# EAGLE schematic sensor_003 (EAGLE 7.3.0)
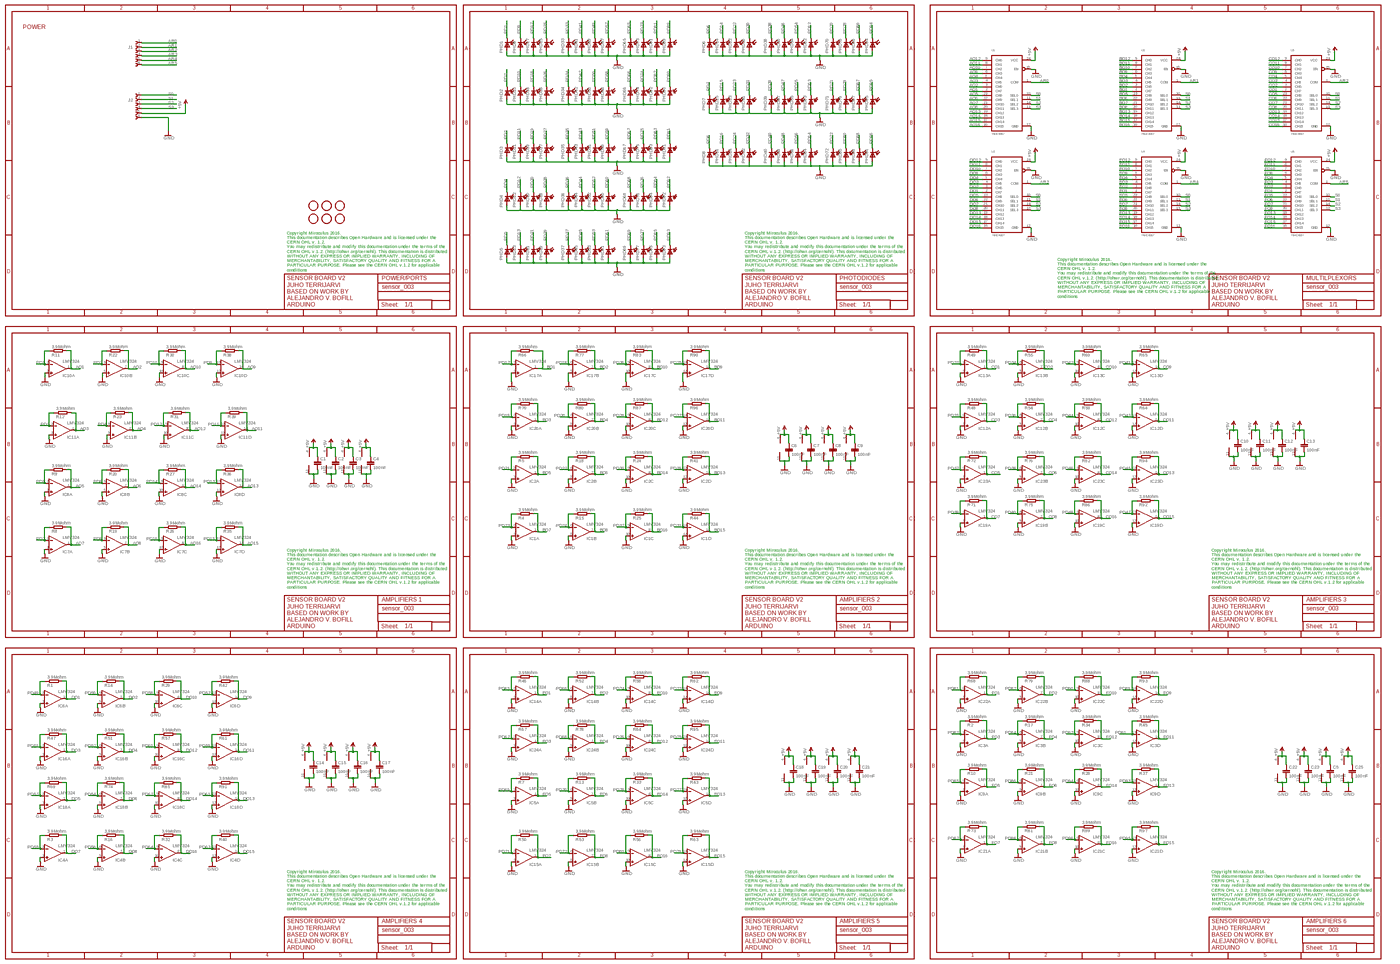
[diagram p0: schematic, sheet 1, overview]
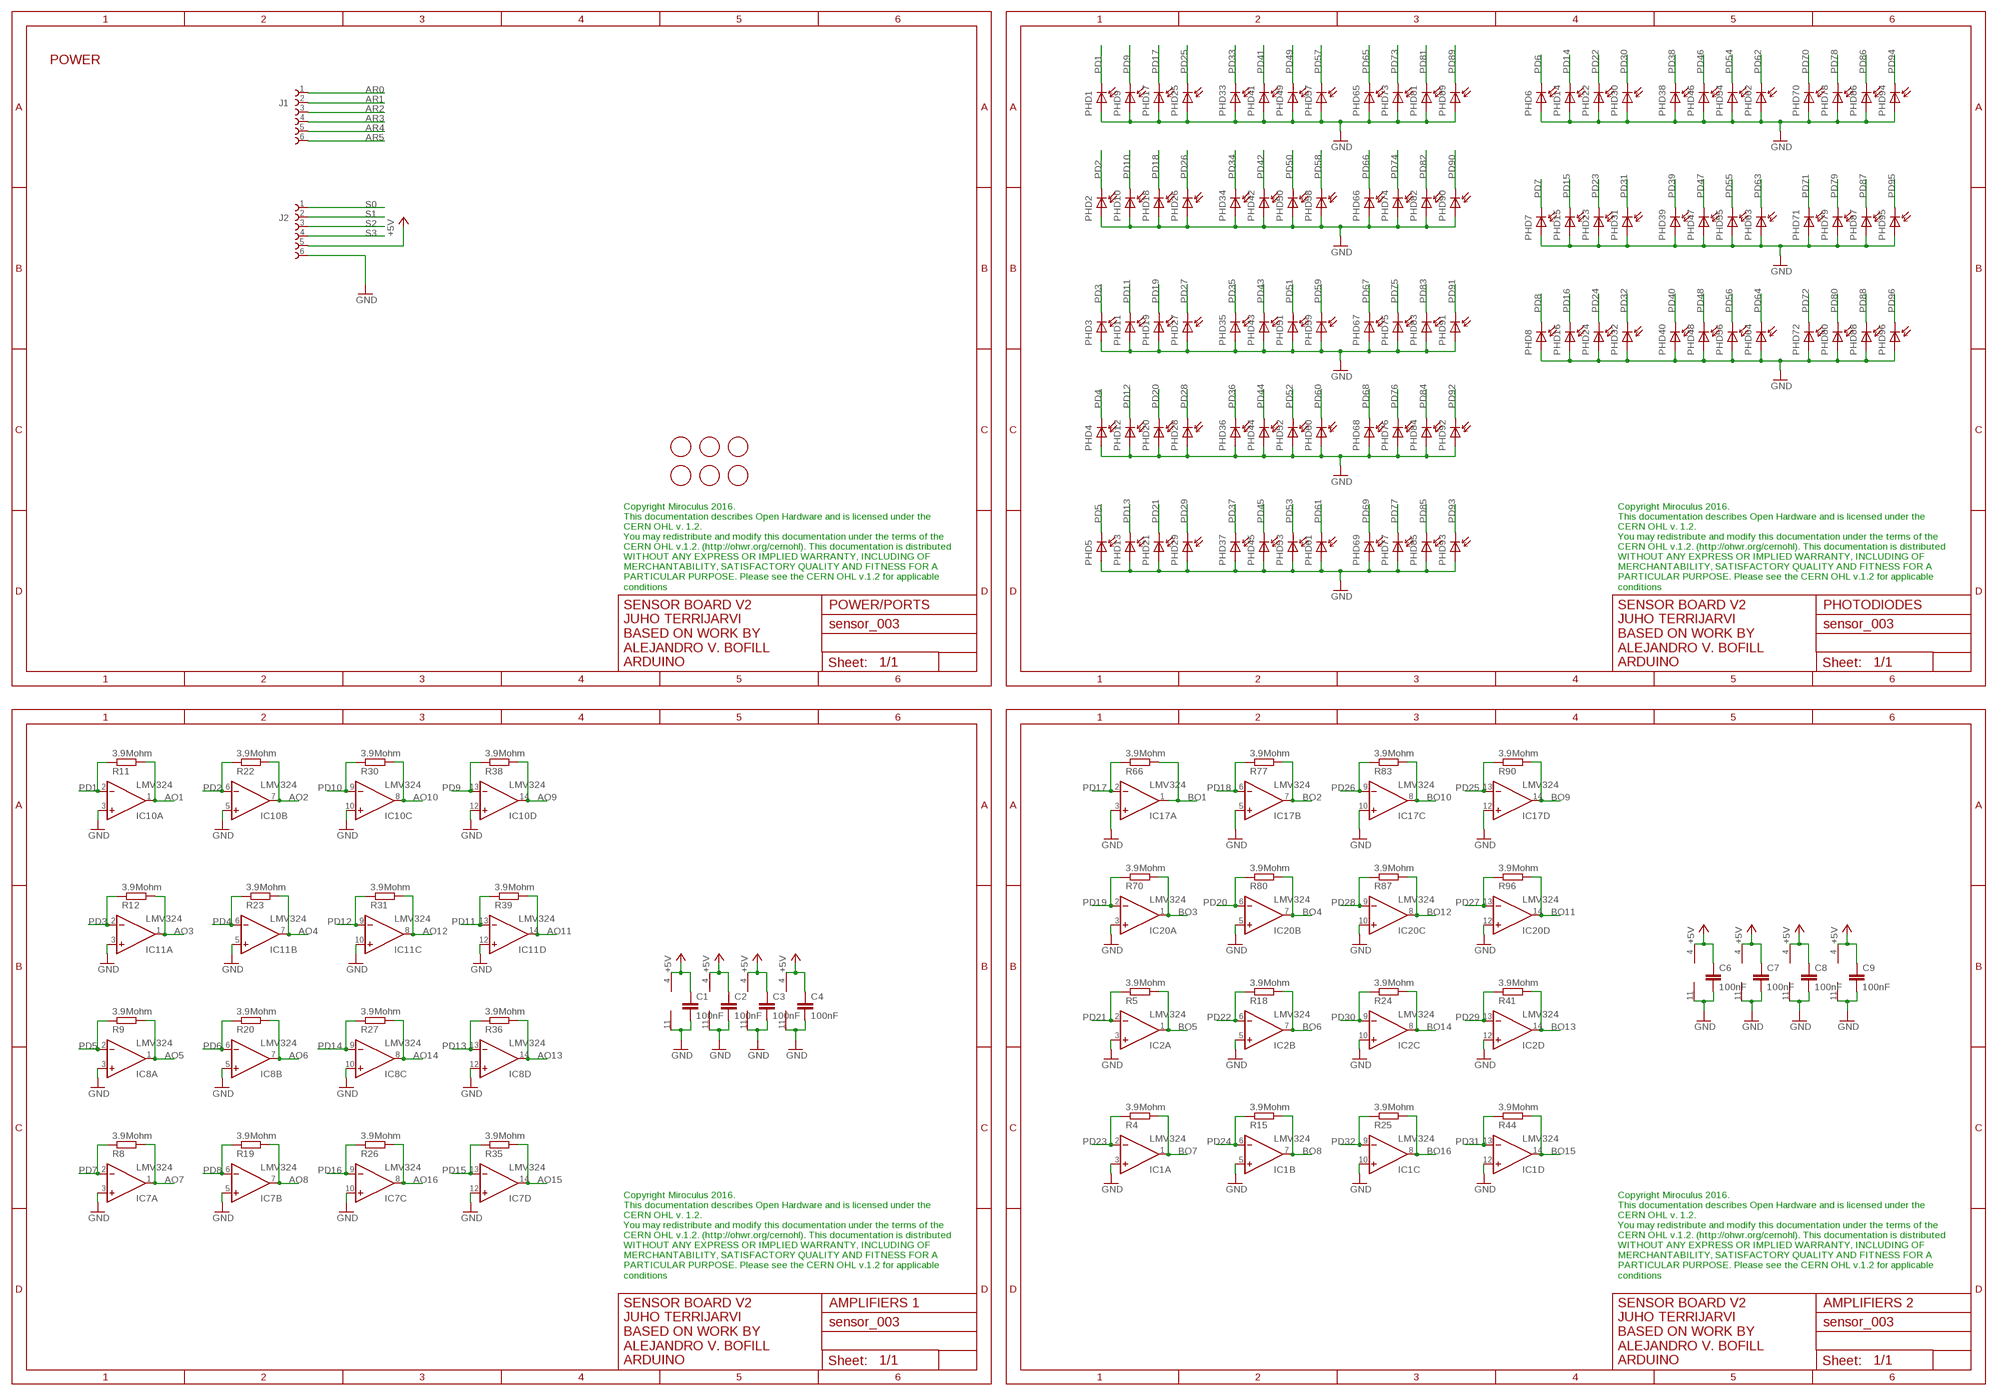
[diagram p1: schematic, sheet 1, part 1 of 4]
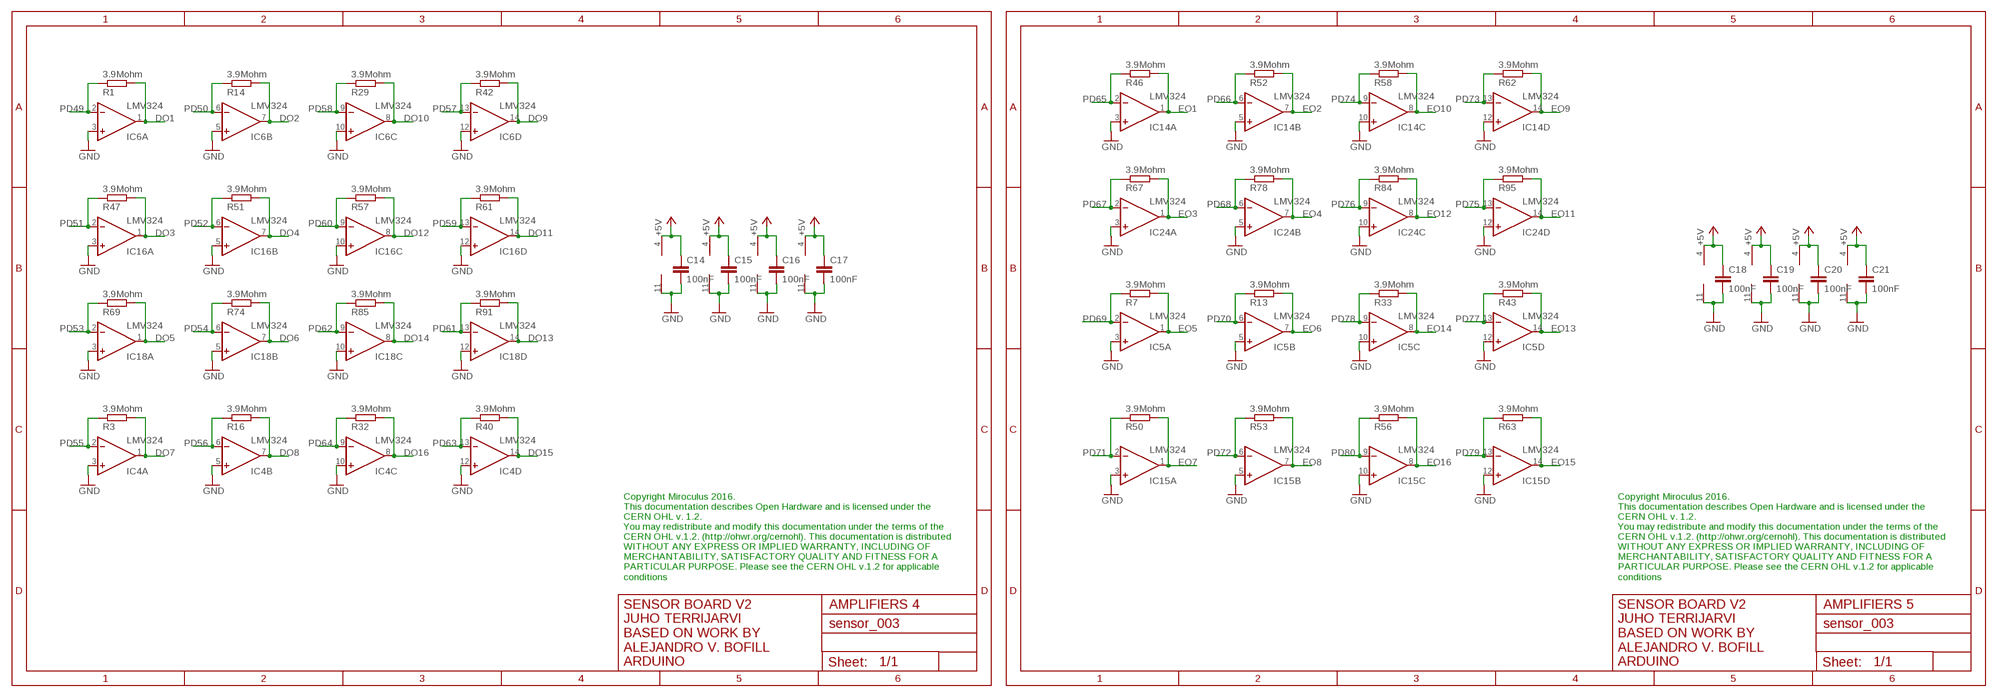
[diagram p2: schematic, sheet 1, part 2 of 4]
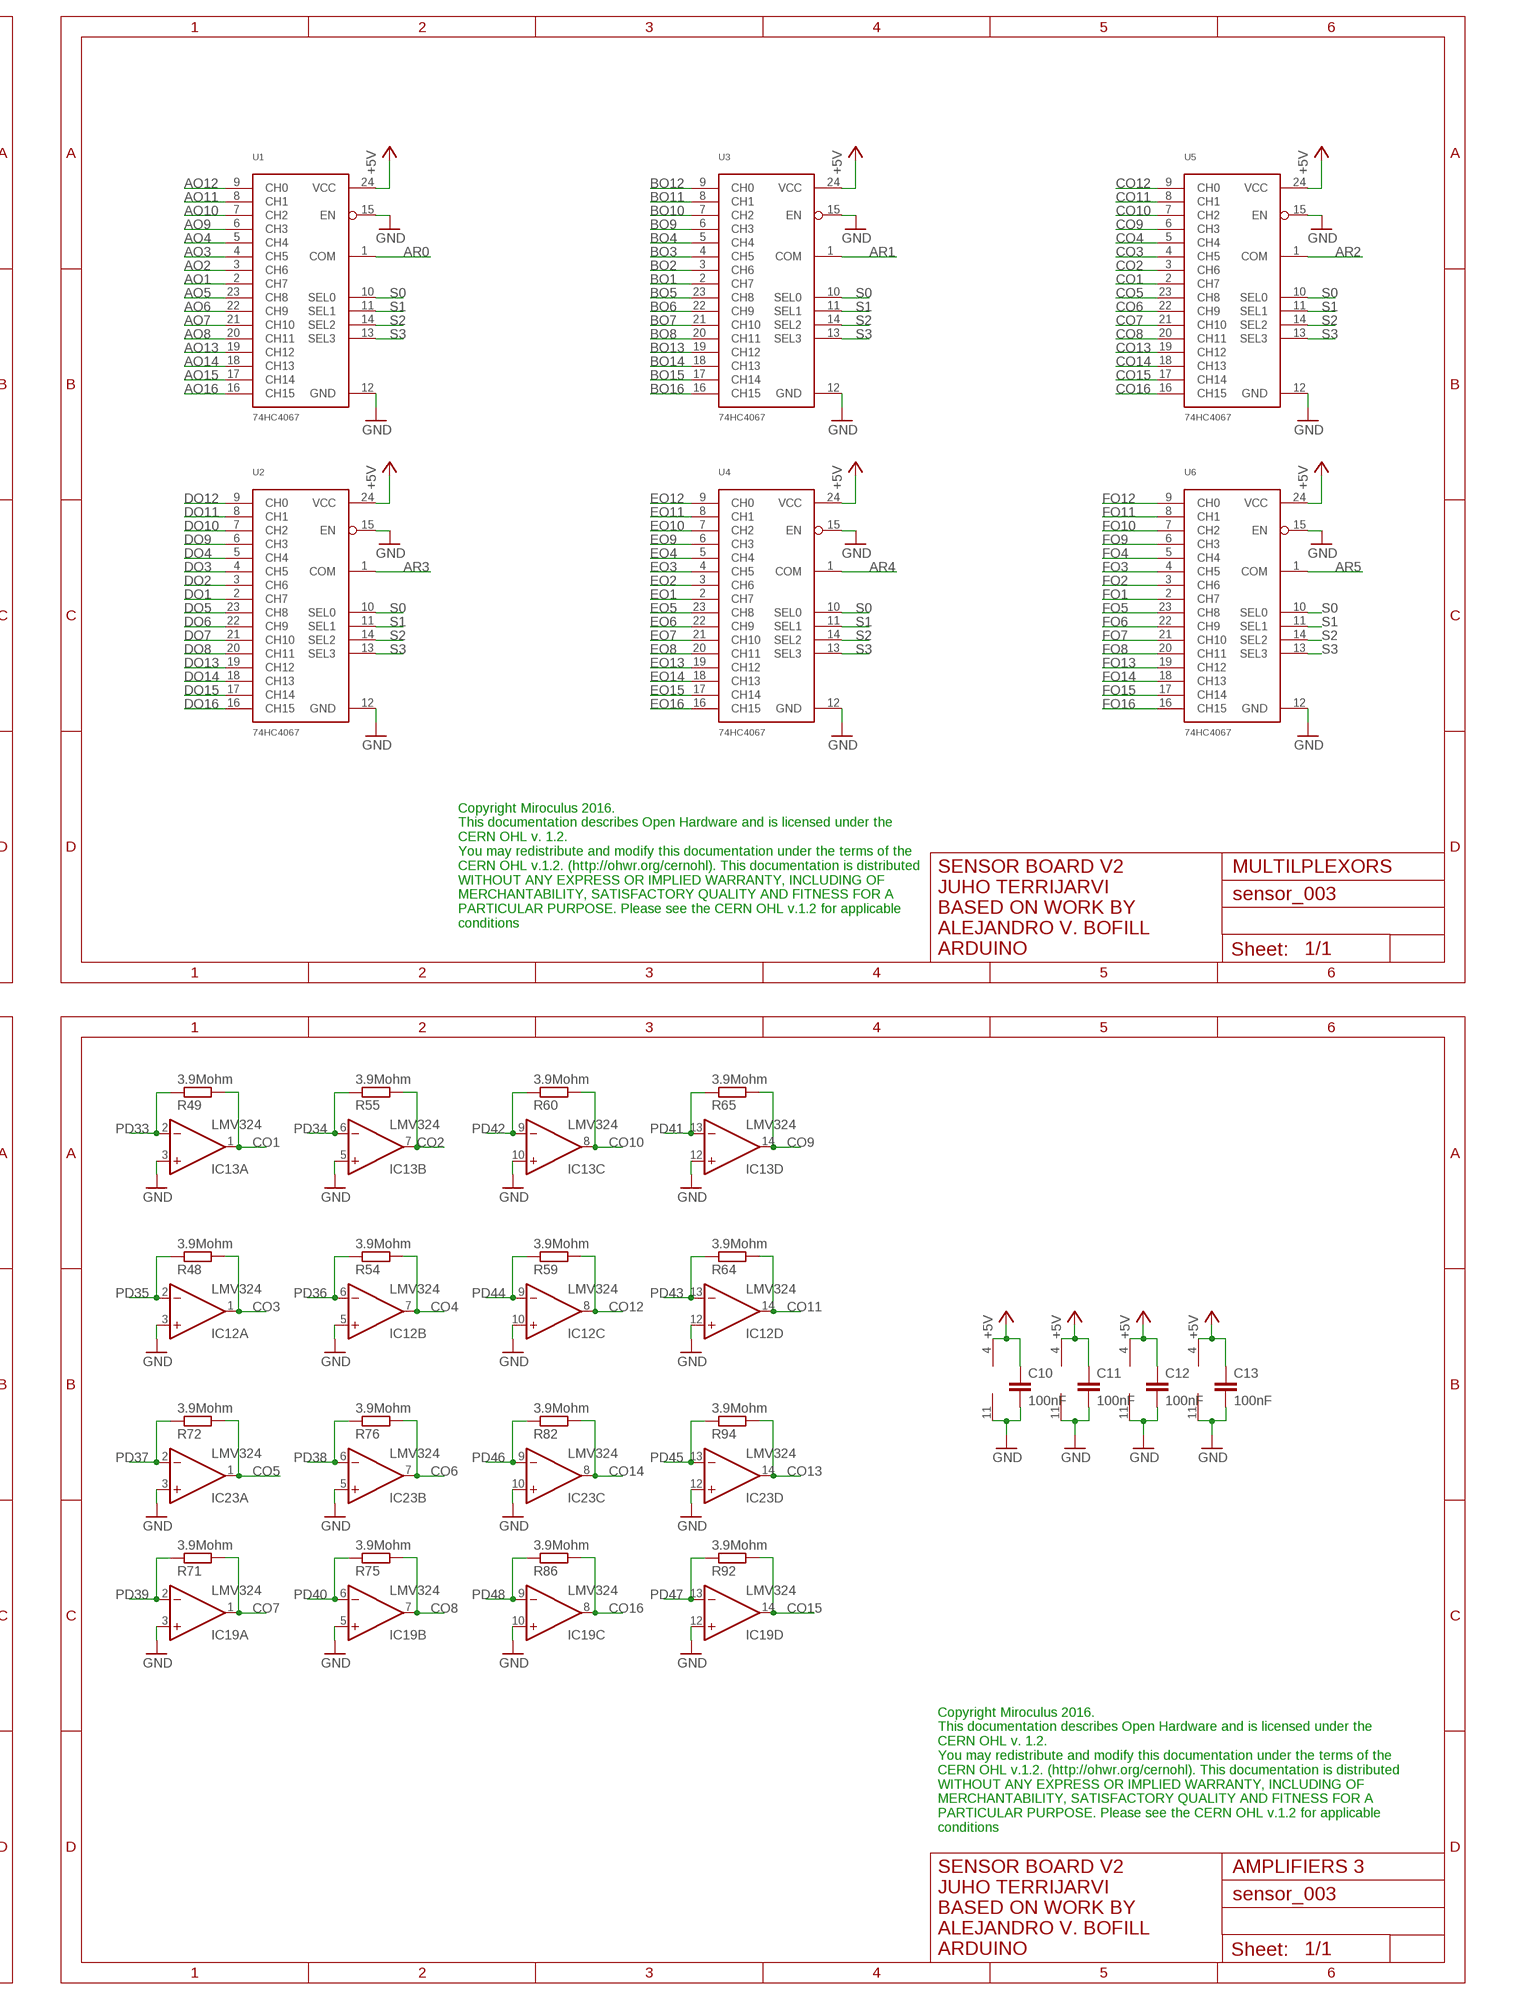
[diagram p3: schematic, sheet 1, part 3 of 4]
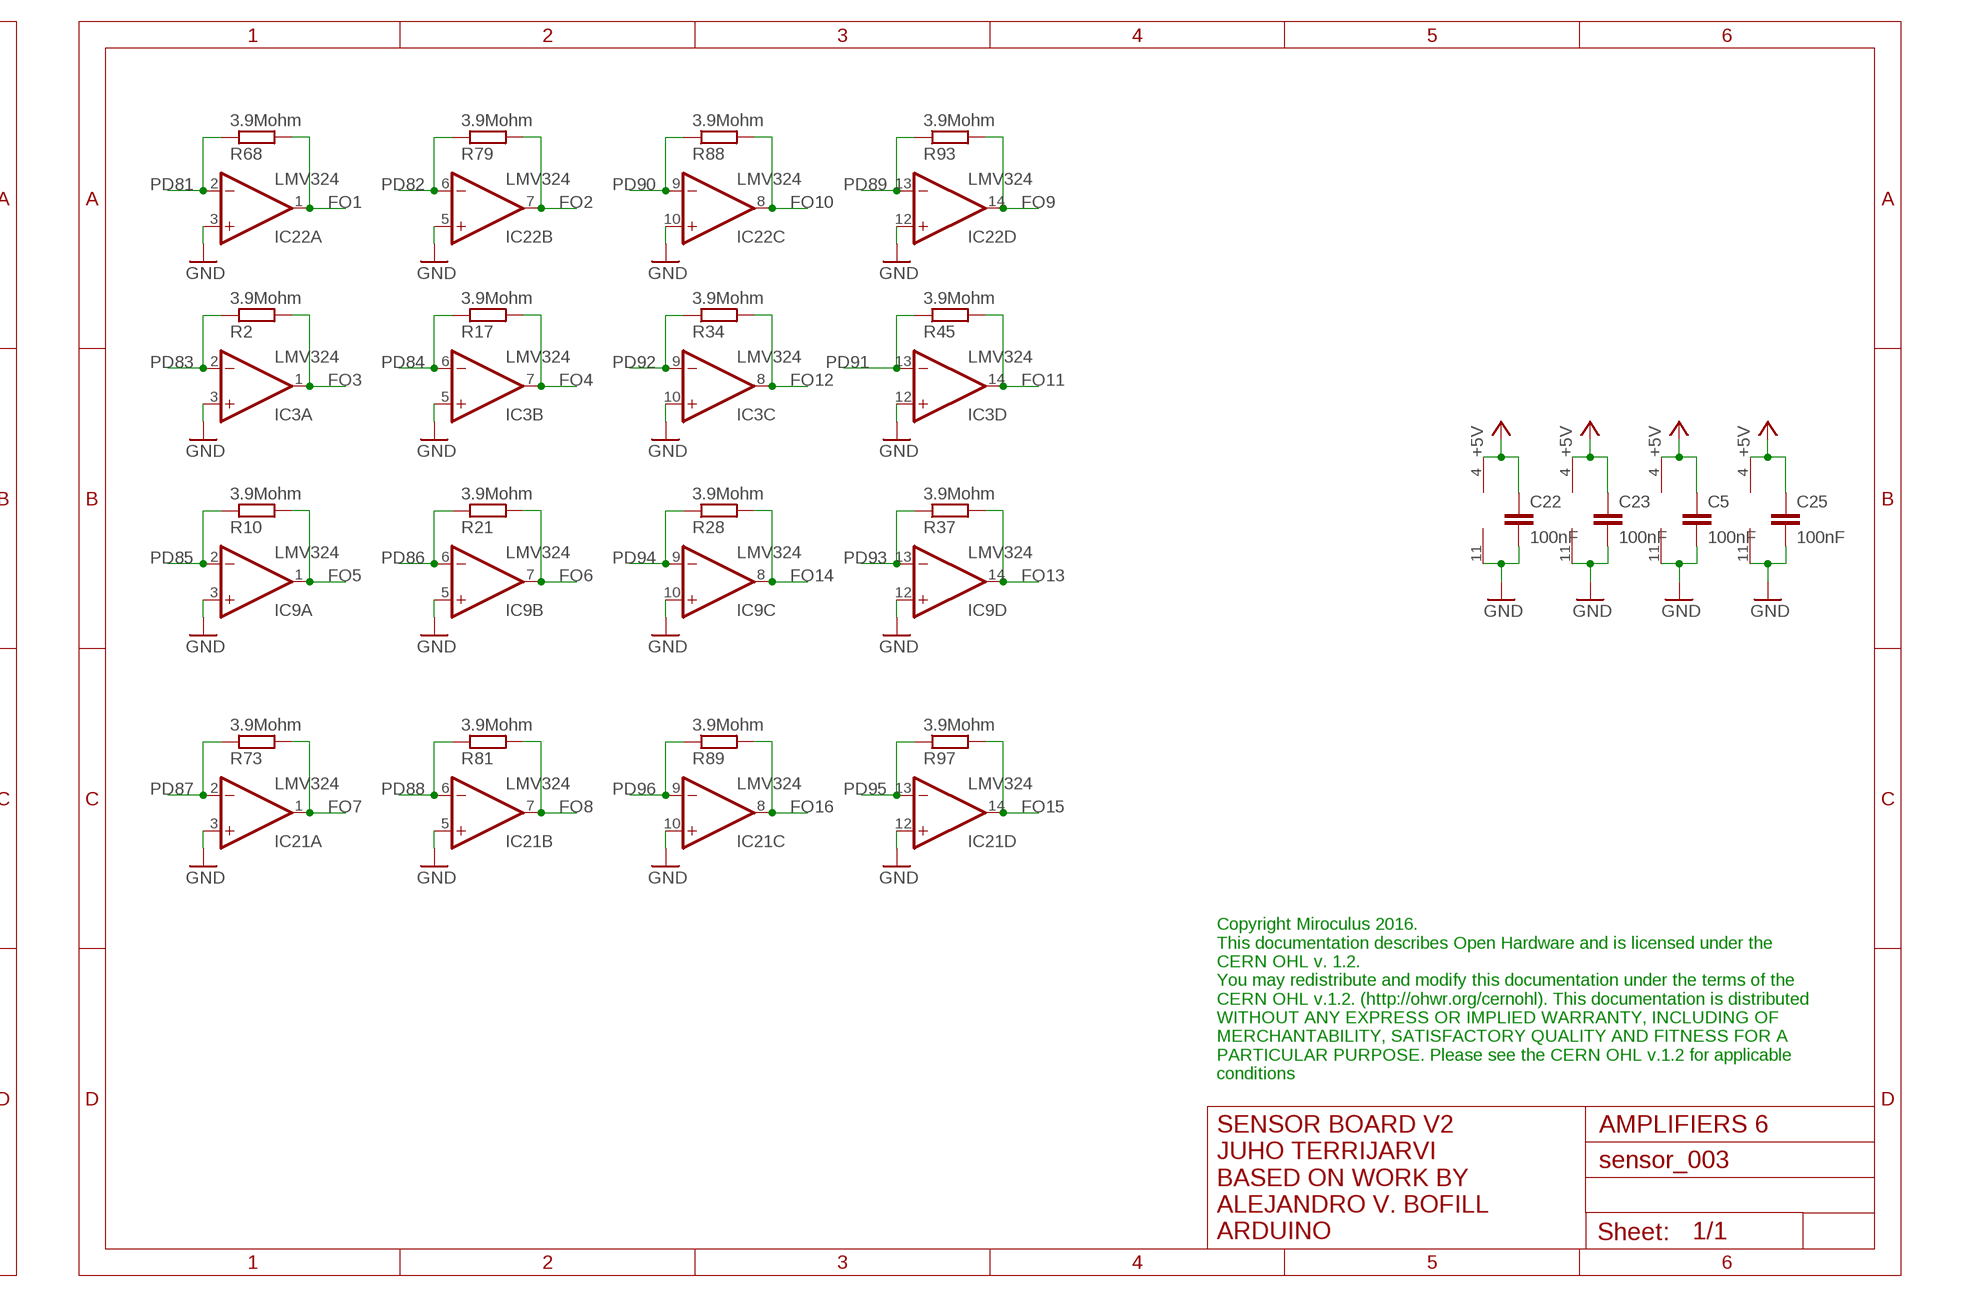
[diagram p4: schematic, sheet 1, part 4 of 4]

## Parts
C1  100nF  C-EUC0603  [C0603]
C2  100nF  C-EUC0603  [C0603]
C3  100nF  C-EUC0603  [C0603]
C4  100nF  C-EUC0603  [C0603]
C5  100nF  C-EUC0603  [C0603]
C6  100nF  C-EUC0603  [C0603]
C7  100nF  C-EUC0603  [C0603]
C8  100nF  C-EUC0603  [C0603]
C9  100nF  C-EUC0603  [C0603]
C10  100nF  C-EUC0603  [C0603]
C11  100nF  C-EUC0603  [C0603]
C12  100nF  C-EUC0603  [C0603]
C13  100nF  C-EUC0603  [C0603]
C14  100nF  C-EUC0603  [C0603]
C15  100nF  C-EUC0603  [C0603]
C16  100nF  C-EUC0603  [C0603]
C17  100nF  C-EUC0603  [C0603]
C18  100nF  C-EUC0603  [C0603]
C19  100nF  C-EUC0603  [C0603]
C20  100nF  C-EUC0603  [C0603]
C21  100nF  C-EUC0603  [C0603]
C22  100nF  C-EUC0603  [C0603]
C23  100nF  C-EUC0603  [C0603]
C25  100nF  C-EUC0603  [C0603]
FD1  FIDUCIALMOUNT  [FIDUCIA-MOUNT]
FD2  FIDUCIALMOUNT  [FIDUCIA-MOUNT]
FD3  FIDUCIALMOUNT  [FIDUCIA-MOUNT]
FD4  FIDUCIALMOUNT  [FIDUCIA-MOUNT]
FD5  FIDUCIALMOUNT  [FIDUCIA-MOUNT]
FD6  FIDUCIALMOUNT  [FIDUCIA-MOUNT]
IC1  LMV324  TL074D  [SO14]
IC2  LMV324  TL074D  [SO14]
IC3  LMV324  TL074D  [SO14]
IC4  LMV324  TL074D  [SO14]
IC5  LMV324  TL074D  [SO14]
IC6  LMV324  TL074D  [SO14]
IC7  LMV324  TL074D  [SO14]
IC8  LMV324  TL074D  [SO14]
IC9  LMV324  TL074D  [SO14]
IC10  LMV324  TL074D  [SO14]
IC11  LMV324  TL074D  [SO14]
IC12  LMV324  TL074D  [SO14]
IC13  LMV324  TL074D  [SO14]
IC14  LMV324  TL074D  [SO14]
IC15  LMV324  TL074D  [SO14]
IC16  LMV324  TL074D  [SO14]
IC17  LMV324  TL074D  [SO14]
IC18  LMV324  TL074D  [SO14]
IC19  LMV324  TL074D  [SO14]
IC20  LMV324  TL074D  [SO14]
IC21  LMV324  TL074D  [SO14]
IC22  LMV324  TL074D  [SO14]
IC23  LMV324  TL074D  [SO14]
IC24  LMV324  TL074D  [SO14]
J1  68710614522  [68710614522]
J2  68710614522  [68710614522]
PHD1  CLS15-22C/L213G/TR8  PD_0.2  [PD_0.2]
PHD2  CLS15-22C/L213G/TR8  PD_0.2  [PD_0.2]
PHD3  CLS15-22C/L213G/TR8  PD_0.2  [PD_0.2]
PHD4  CLS15-22C/L213G/TR8  PD_0.2  [PD_0.2]
PHD5  CLS15-22C/L213G/TR8  PD_0.2  [PD_0.2]
PHD6  CLS15-22C/L213G/TR8  PD_0.2  [PD_0.2]
PHD7  CLS15-22C/L213G/TR8  PD_0.2  [PD_0.2]
PHD8  CLS15-22C/L213G/TR8  PD_0.2  [PD_0.2]
PHD9  CLS15-22C/L213G/TR8  PD_0.2  [PD_0.2]
PHD10  CLS15-22C/L213G/TR8  PD_0.2  [PD_0.2]
PHD11  CLS15-22C/L213G/TR8  PD_0.2  [PD_0.2]
PHD12  CLS15-22C/L213G/TR8  PD_0.2  [PD_0.2]
PHD13  CLS15-22C/L213G/TR8  PD_0.2  [PD_0.2]
PHD14  CLS15-22C/L213G/TR8  PD_0.2  [PD_0.2]
PHD15  CLS15-22C/L213G/TR8  PD_0.2  [PD_0.2]
PHD16  CLS15-22C/L213G/TR8  PD_0.2  [PD_0.2]
PHD17  CLS15-22C/L213G/TR8  PD_0.2  [PD_0.2]
PHD18  CLS15-22C/L213G/TR8  PD_0.2  [PD_0.2]
PHD19  CLS15-22C/L213G/TR8  PD_0.2  [PD_0.2]
PHD20  CLS15-22C/L213G/TR8  PD_0.2  [PD_0.2]
PHD21  CLS15-22C/L213G/TR8  PD_0.2  [PD_0.2]
PHD22  CLS15-22C/L213G/TR8  PD_0.2  [PD_0.2]
PHD23  CLS15-22C/L213G/TR8  PD_0.2  [PD_0.2]
PHD24  CLS15-22C/L213G/TR8  PD_0.2  [PD_0.2]
PHD25  CLS15-22C/L213G/TR8  PD_0.2  [PD_0.2]
PHD26  CLS15-22C/L213G/TR8  PD_0.2  [PD_0.2]
PHD27  CLS15-22C/L213G/TR8  PD_0.2  [PD_0.2]
PHD28  CLS15-22C/L213G/TR8  PD_0.2  [PD_0.2]
PHD29  CLS15-22C/L213G/TR8  PD_0.2  [PD_0.2]
PHD30  CLS15-22C/L213G/TR8  PD_0.2  [PD_0.2]
PHD31  CLS15-22C/L213G/TR8  PD_0.2  [PD_0.2]
PHD32  CLS15-22C/L213G/TR8  PD_0.2  [PD_0.2]
PHD33  CLS15-22C/L213G/TR8  PD_0.2  [PD_0.2]
PHD34  CLS15-22C/L213G/TR8  PD_0.2  [PD_0.2]
PHD35  CLS15-22C/L213G/TR8  PD_0.2  [PD_0.2]
PHD36  CLS15-22C/L213G/TR8  PD_0.2  [PD_0.2]
PHD37  CLS15-22C/L213G/TR8  PD_0.2  [PD_0.2]
PHD38  CLS15-22C/L213G/TR8  PD_0.2  [PD_0.2]
PHD39  CLS15-22C/L213G/TR8  PD_0.2  [PD_0.2]
PHD40  CLS15-22C/L213G/TR8  PD_0.2  [PD_0.2]
PHD41  CLS15-22C/L213G/TR8  PD_0.2  [PD_0.2]
PHD42  CLS15-22C/L213G/TR8  PD_0.2  [PD_0.2]
PHD43  CLS15-22C/L213G/TR8  PD_0.2  [PD_0.2]
PHD44  CLS15-22C/L213G/TR8  PD_0.2  [PD_0.2]
PHD45  CLS15-22C/L213G/TR8  PD_0.2  [PD_0.2]
PHD46  CLS15-22C/L213G/TR8  PD_0.2  [PD_0.2]
PHD47  CLS15-22C/L213G/TR8  PD_0.2  [PD_0.2]
PHD48  CLS15-22C/L213G/TR8  PD_0.2  [PD_0.2]
PHD49  CLS15-22C/L213G/TR8  PD_0.2  [PD_0.2]
PHD50  CLS15-22C/L213G/TR8  PD_0.2  [PD_0.2]
PHD51  CLS15-22C/L213G/TR8  PD_0.2  [PD_0.2]
PHD52  CLS15-22C/L213G/TR8  PD_0.2  [PD_0.2]
PHD53  CLS15-22C/L213G/TR8  PD_0.2  [PD_0.2]
PHD54  CLS15-22C/L213G/TR8  PD_0.2  [PD_0.2]
PHD55  CLS15-22C/L213G/TR8  PD_0.2  [PD_0.2]
PHD56  CLS15-22C/L213G/TR8  PD_0.2  [PD_0.2]
PHD57  CLS15-22C/L213G/TR8  PD_0.2  [PD_0.2]
PHD58  CLS15-22C/L213G/TR8  PD_0.2  [PD_0.2]
PHD59  CLS15-22C/L213G/TR8  PD_0.2  [PD_0.2]
PHD60  CLS15-22C/L213G/TR8  PD_0.2  [PD_0.2]
PHD61  CLS15-22C/L213G/TR8  PD_0.2  [PD_0.2]
PHD62  CLS15-22C/L213G/TR8  PD_0.2  [PD_0.2]
PHD63  CLS15-22C/L213G/TR8  PD_0.2  [PD_0.2]
PHD64  CLS15-22C/L213G/TR8  PD_0.2  [PD_0.2]
PHD65  CLS15-22C/L213G/TR8  PD_0.2  [PD_0.2]
PHD66  CLS15-22C/L213G/TR8  PD_0.2  [PD_0.2]
PHD67  CLS15-22C/L213G/TR8  PD_0.2  [PD_0.2]
PHD68  CLS15-22C/L213G/TR8  PD_0.2  [PD_0.2]
PHD69  CLS15-22C/L213G/TR8  PD_0.2  [PD_0.2]
PHD70  CLS15-22C/L213G/TR8  PD_0.2  [PD_0.2]
PHD71  CLS15-22C/L213G/TR8  PD_0.2  [PD_0.2]
PHD72  CLS15-22C/L213G/TR8  PD_0.2  [PD_0.2]
PHD73  CLS15-22C/L213G/TR8  PD_0.2  [PD_0.2]
PHD74  CLS15-22C/L213G/TR8  PD_0.2  [PD_0.2]
PHD75  CLS15-22C/L213G/TR8  PD_0.2  [PD_0.2]
PHD76  CLS15-22C/L213G/TR8  PD_0.2  [PD_0.2]
PHD77  CLS15-22C/L213G/TR8  PD_0.2  [PD_0.2]
PHD78  CLS15-22C/L213G/TR8  PD_0.2  [PD_0.2]
PHD79  CLS15-22C/L213G/TR8  PD_0.2  [PD_0.2]
PHD80  CLS15-22C/L213G/TR8  PD_0.2  [PD_0.2]
PHD81  CLS15-22C/L213G/TR8  PD_0.2  [PD_0.2]
PHD82  CLS15-22C/L213G/TR8  PD_0.2  [PD_0.2]
PHD83  CLS15-22C/L213G/TR8  PD_0.2  [PD_0.2]
PHD84  CLS15-22C/L213G/TR8  PD_0.2  [PD_0.2]
PHD85  CLS15-22C/L213G/TR8  PD_0.2  [PD_0.2]
PHD86  CLS15-22C/L213G/TR8  PD_0.2  [PD_0.2]
PHD87  CLS15-22C/L213G/TR8  PD_0.2  [PD_0.2]
PHD88  CLS15-22C/L213G/TR8  PD_0.2  [PD_0.2]
PHD89  CLS15-22C/L213G/TR8  PD_0.2  [PD_0.2]
PHD90  CLS15-22C/L213G/TR8  PD_0.2  [PD_0.2]
PHD91  CLS15-22C/L213G/TR8  PD_0.2  [PD_0.2]
PHD92  CLS15-22C/L213G/TR8  PD_0.2  [PD_0.2]
PHD93  CLS15-22C/L213G/TR8  PD_0.2  [PD_0.2]
PHD94  CLS15-22C/L213G/TR8  PD_0.2  [PD_0.2]
PHD95  CLS15-22C/L213G/TR8  PD_0.2  [PD_0.2]
PHD96  CLS15-22C/L213G/TR8  PD_0.2  [PD_0.2]
R1  3.9Mohm  R-EU_R0603  [R0603]
R2  3.9Mohm  R-EU_R0603  [R0603]
R3  3.9Mohm  R-EU_R0603  [R0603]
R4  3.9Mohm  R-EU_R0603  [R0603]
R5  3.9Mohm  R-EU_R0603  [R0603]
R7  3.9Mohm  R-EU_R0603  [R0603]
R8  3.9Mohm  R-EU_R0603  [R0603]
R9  3.9Mohm  R-EU_R0603  [R0603]
R10  3.9Mohm  R-EU_R0603  [R0603]
R11  3.9Mohm  R-EU_R0603  [R0603]
R12  3.9Mohm  R-EU_R0603  [R0603]
R13  3.9Mohm  R-EU_R0603  [R0603]
R14  3.9Mohm  R-EU_R0603  [R0603]
R15  3.9Mohm  R-EU_R0603  [R0603]
R16  3.9Mohm  R-EU_R0603  [R0603]
R17  3.9Mohm  R-EU_R0603  [R0603]
R18  3.9Mohm  R-EU_R0603  [R0603]
R19  3.9Mohm  R-EU_R0603  [R0603]
R20  3.9Mohm  R-EU_R0603  [R0603]
R21  3.9Mohm  R-EU_R0603  [R0603]
R22  3.9Mohm  R-EU_R0603  [R0603]
R23  3.9Mohm  R-EU_R0603  [R0603]
R24  3.9Mohm  R-EU_R0603  [R0603]
R25  3.9Mohm  R-EU_R0603  [R0603]
R26  3.9Mohm  R-EU_R0603  [R0603]
R27  3.9Mohm  R-EU_R0603  [R0603]
R28  3.9Mohm  R-EU_R0603  [R0603]
R29  3.9Mohm  R-EU_R0603  [R0603]
R30  3.9Mohm  R-EU_R0603  [R0603]
R31  3.9Mohm  R-EU_R0603  [R0603]
R32  3.9Mohm  R-EU_R0603  [R0603]
R33  3.9Mohm  R-EU_R0603  [R0603]
R34  3.9Mohm  R-EU_R0603  [R0603]
R35  3.9Mohm  R-EU_R0603  [R0603]
R36  3.9Mohm  R-EU_R0603  [R0603]
R37  3.9Mohm  R-EU_R0603  [R0603]
R38  3.9Mohm  R-EU_R0603  [R0603]
R39  3.9Mohm  R-EU_R0603  [R0603]
R40  3.9Mohm  R-EU_R0603  [R0603]
R41  3.9Mohm  R-EU_R0603  [R0603]
R42  3.9Mohm  R-EU_R0603  [R0603]
R43  3.9Mohm  R-EU_R0603  [R0603]
R44  3.9Mohm  R-EU_R0603  [R0603]
R45  3.9Mohm  R-EU_R0603  [R0603]
R46  3.9Mohm  R-EU_R0603  [R0603]
R47  3.9Mohm  R-EU_R0603  [R0603]
R48  3.9Mohm  R-EU_R0603  [R0603]
R49  3.9Mohm  R-EU_R0603  [R0603]
R50  3.9Mohm  R-EU_R0603  [R0603]
R51  3.9Mohm  R-EU_R0603  [R0603]
R52  3.9Mohm  R-EU_R0603  [R0603]
R53  3.9Mohm  R-EU_R0603  [R0603]
R54  3.9Mohm  R-EU_R0603  [R0603]
R55  3.9Mohm  R-EU_R0603  [R0603]
R56  3.9Mohm  R-EU_R0603  [R0603]
R57  3.9Mohm  R-EU_R0603  [R0603]
R58  3.9Mohm  R-EU_R0603  [R0603]
R59  3.9Mohm  R-EU_R0603  [R0603]
R60  3.9Mohm  R-EU_R0603  [R0603]
R61  3.9Mohm  R-EU_R0603  [R0603]
R62  3.9Mohm  R-EU_R0603  [R0603]
R63  3.9Mohm  R-EU_R0603  [R0603]
R64  3.9Mohm  R-EU_R0603  [R0603]
R65  3.9Mohm  R-EU_R0603  [R0603]
R66  3.9Mohm  R-EU_R0603  [R0603]
R67  3.9Mohm  R-EU_R0603  [R0603]
R68  3.9Mohm  R-EU_R0603  [R0603]
R69  3.9Mohm  R-EU_R0603  [R0603]
R70  3.9Mohm  R-EU_R0603  [R0603]
R71  3.9Mohm  R-EU_R0603  [R0603]
R72  3.9Mohm  R-EU_R0603  [R0603]
R73  3.9Mohm  R-EU_R0603  [R0603]
R74  3.9Mohm  R-EU_R0603  [R0603]
R75  3.9Mohm  R-EU_R0603  [R0603]
R76  3.9Mohm  R-EU_R0603  [R0603]
R77  3.9Mohm  R-EU_R0603  [R0603]
R78  3.9Mohm  R-EU_R0603  [R0603]
R79  3.9Mohm  R-EU_R0603  [R0603]
R80  3.9Mohm  R-EU_R0603  [R0603]
R81  3.9Mohm  R-EU_R0603  [R0603]
R82  3.9Mohm  R-EU_R0603  [R0603]
R83  3.9Mohm  R-EU_R0603  [R0603]
R84  3.9Mohm  R-EU_R0603  [R0603]
R85  3.9Mohm  R-EU_R0603  [R0603]
R86  3.9Mohm  R-EU_R0603  [R0603]
R87  3.9Mohm  R-EU_R0603  [R0603]
R88  3.9Mohm  R-EU_R0603  [R0603]
R89  3.9Mohm  R-EU_R0603  [R0603]
R90  3.9Mohm  R-EU_R0603  [R0603]
R91  3.9Mohm  R-EU_R0603  [R0603]
R92  3.9Mohm  R-EU_R0603  [R0603]
R93  3.9Mohm  R-EU_R0603  [R0603]
R94  3.9Mohm  R-EU_R0603  [R0603]
R95  3.9Mohm  R-EU_R0603  [R0603]
R96  3.9Mohm  R-EU_R0603  [R0603]
R97  3.9Mohm  R-EU_R0603  [R0603]
U1  74HC4067  MUX-1X16  [SSOP24]
U2  74HC4067  MUX-1X16  [SSOP24]
U3  74HC4067  MUX-1X16  [SSOP24]
U4  74HC4067  MUX-1X16  [SSOP24]
U5  74HC4067  MUX-1X16  [SSOP24]
U6  74HC4067  MUX-1X16  [SSOP24]

## Nets
+5V: C1.1 C2.1 C3.1 C4.1 C5.1 C6.1 C7.1 C8.1 C9.1 C10.1 C11.1 C12.1 C13.1 C14.1 C15.1 C16.1 C17.1 C18.1 C19.1 C20.1 C21.1 C22.1 C23.1 C25.1 IC1.4(P:V+) IC2.4(P:V+) IC3.4(P:V+) IC4.4(P:V+) IC5.4(P:V+) IC6.4(P:V+) IC7.4(P:V+) IC8.4(P:V+) IC9.4(P:V+) IC10.4(P:V+) IC11.4(P:V+) IC12.4(P:V+) IC13.4(P:V+) IC14.4(P:V+) IC15.4(P:V+) IC16.4(P:V+) IC17.4(P:V+) IC18.4(P:V+) IC19.4(P:V+) IC20.4(P:V+) IC21.4(P:V+) IC22.4(P:V+) IC23.4(P:V+) IC24.4(P:V+) J2.5 U1.24(VCC) U2.24(VCC) U3.24(VCC) U4.24(VCC) U5.24(VCC) U6.24(VCC)
AO1: IC10.1(A:OUT) R11.2 U1.2(CH7)
AO2: IC10.7(B:OUT) R22.2 U1.3(CH6)
AO3: IC11.1(A:OUT) R12.2 U1.4(CH5)
AO4: IC11.7(B:OUT) R23.2 U1.5(CH4)
AO5: IC8.1(A:OUT) R9.2 U1.23(CH8)
AO6: IC8.7(B:OUT) R20.2 U1.22(CH9)
AO7: IC7.1(A:OUT) R8.2 U1.21(CH10)
AO8: IC7.7(B:OUT) R19.2 U1.20(CH11)
AO9: IC10.14(D:OUT) R38.2 U1.6(CH3)
AO10: IC10.8(C:OUT) R30.2 U1.7(CH2)
AO11: IC11.14(D:OUT) R39.2 U1.8(CH1)
AO12: IC11.8(C:OUT) R31.2 U1.9(CH0)
AO13: IC8.14(D:OUT) R36.2 U1.19(CH12)
AO14: IC8.8(C:OUT) R27.2 U1.18(CH13)
AO15: IC7.14(D:OUT) R35.2 U1.17(CH14)
AO16: IC7.8(C:OUT) R26.2 U1.16(CH15)
AR0: J1.1 U1.1(COM)
AR1: J1.2 U3.1(COM)
AR2: J1.3 U5.1(COM)
AR3: J1.4 U2.1(COM)
AR4: J1.5 U4.1(COM)
AR5: J1.6 U6.1(COM)
BO1: IC17.1(A:OUT) R66.2 U3.2(CH7)
BO2: IC17.7(B:OUT) R77.2 U3.3(CH6)
BO3: IC20.1(A:OUT) R70.2 U3.4(CH5)
BO4: IC20.7(B:OUT) R80.2 U3.5(CH4)
BO5: IC2.1(A:OUT) R5.2 U3.23(CH8)
BO6: IC2.7(B:OUT) R18.2 U3.22(CH9)
BO7: IC1.1(A:OUT) R4.2 U3.21(CH10)
BO8: IC1.7(B:OUT) R15.2 U3.20(CH11)
BO9: IC17.14(D:OUT) R90.2 U3.6(CH3)
BO10: IC17.8(C:OUT) R83.2 U3.7(CH2)
BO11: IC20.14(D:OUT) R96.2 U3.8(CH1)
BO12: IC20.8(C:OUT) R87.2 U3.9(CH0)
BO13: IC2.14(D:OUT) R41.2 U3.19(CH12)
BO14: IC2.8(C:OUT) R24.2 U3.18(CH13)
BO15: IC1.14(D:OUT) R44.2 U3.17(CH14)
BO16: IC1.8(C:OUT) R25.2 U3.16(CH15)
CO1: IC13.1(A:OUT) R49.2 U5.2(CH7)
CO2: IC13.7(B:OUT) R55.2 U5.3(CH6)
CO3: IC12.1(A:OUT) R48.2 U5.4(CH5)
CO4: IC12.7(B:OUT) R54.2 U5.5(CH4)
CO5: IC23.1(A:OUT) R72.2 U5.23(CH8)
CO6: IC23.7(B:OUT) R76.2 U5.22(CH9)
CO7: IC19.1(A:OUT) R71.2 U5.21(CH10)
CO8: IC19.7(B:OUT) R75.2 U5.20(CH11)
CO9: IC13.14(D:OUT) R65.2 U5.6(CH3)
CO10: IC13.8(C:OUT) R60.2 U5.7(CH2)
CO11: IC12.14(D:OUT) R64.2 U5.8(CH1)
CO12: IC12.8(C:OUT) R59.2 U5.9(CH0)
CO13: IC23.14(D:OUT) R94.2 U5.19(CH12)
CO14: IC23.8(C:OUT) R82.2 U5.18(CH13)
CO15: IC19.14(D:OUT) R92.2 U5.17(CH14)
CO16: IC19.8(C:OUT) R86.2 U5.16(CH15)
DO1: IC6.1(A:OUT) R1.2 U2.2(CH7)
DO2: IC6.7(B:OUT) R14.2 U2.3(CH6)
DO3: IC16.1(A:OUT) R47.2 U2.4(CH5)
DO4: IC16.7(B:OUT) R51.2 U2.5(CH4)
DO5: IC18.1(A:OUT) R69.2 U2.23(CH8)
DO6: IC18.7(B:OUT) R74.2 U2.22(CH9)
DO7: IC4.1(A:OUT) R3.2 U2.21(CH10)
DO8: IC4.7(B:OUT) R16.2 U2.20(CH11)
DO9: IC6.14(D:OUT) R42.2 U2.6(CH3)
DO10: IC6.8(C:OUT) R29.2 U2.7(CH2)
DO11: IC16.14(D:OUT) R61.2 U2.8(CH1)
DO12: IC16.8(C:OUT) R57.2 U2.9(CH0)
DO13: IC18.14(D:OUT) R91.2 U2.19(CH12)
DO14: IC18.8(C:OUT) R85.2 U2.18(CH13)
DO15: IC4.14(D:OUT) R40.2 U2.17(CH14)
DO16: IC4.8(C:OUT) R32.2 U2.16(CH15)
EO1: IC14.1(A:OUT) R46.2 U4.2(CH7)
EO2: IC14.7(B:OUT) R52.2 U4.3(CH6)
EO3: IC24.1(A:OUT) R67.2 U4.4(CH5)
EO4: IC24.7(B:OUT) R78.2 U4.5(CH4)
EO5: IC5.1(A:OUT) R7.2 U4.23(CH8)
EO6: IC5.7(B:OUT) R13.2 U4.22(CH9)
EO7: IC15.1(A:OUT) R50.2 U4.21(CH10)
EO8: IC15.7(B:OUT) R53.2 U4.20(CH11)
EO9: IC14.14(D:OUT) R62.2 U4.6(CH3)
EO10: IC14.8(C:OUT) R58.2 U4.7(CH2)
EO11: IC24.14(D:OUT) R95.2 U4.8(CH1)
EO12: IC24.8(C:OUT) R84.2 U4.9(CH0)
EO13: IC5.14(D:OUT) R43.2 U4.19(CH12)
EO14: IC5.8(C:OUT) R33.2 U4.18(CH13)
EO15: IC15.14(D:OUT) R63.2 U4.17(CH14)
EO16: IC15.8(C:OUT) R56.2 U4.16(CH15)
FO1: IC22.1(A:OUT) R68.2 U6.2(CH7)
FO2: IC22.7(B:OUT) R79.2 U6.3(CH6)
FO3: IC3.1(A:OUT) R2.2 U6.4(CH5)
FO4: IC3.7(B:OUT) R17.2 U6.5(CH4)
FO5: IC9.1(A:OUT) R10.2 U6.23(CH8)
FO6: IC9.7(B:OUT) R21.2 U6.22(CH9)
FO7: IC21.1(A:OUT) R73.2 U6.21(CH10)
FO8: IC21.7(B:OUT) R81.2 U6.20(CH11)
FO9: IC22.14(D:OUT) R93.2 U6.6(CH3)
FO10: IC22.8(C:OUT) R88.2 U6.7(CH2)
FO11: IC3.14(D:OUT) R45.2 U6.8(CH1)
FO12: IC3.8(C:OUT) R34.2 U6.9(CH0)
FO13: IC9.14(D:OUT) R37.2 U6.19(CH12)
FO14: IC9.8(C:OUT) R28.2 U6.18(CH13)
FO15: IC21.14(D:OUT) R97.2 U6.17(CH14)
FO16: IC21.8(C:OUT) R89.2 U6.16(CH15)
GND: C1.2 C2.2 C3.2 C4.2 C5.2 C6.2 C7.2 C8.2 C9.2 C10.2 C11.2 C12.2 C13.2 C14.2 C15.2 C16.2 C17.2 C18.2 C19.2 C20.2 C21.2 C22.2 C23.2 C25.2 IC1.3(A:+IN) IC1.5(B:+IN) IC1.10(C:+IN) IC1.11(P:V-) IC1.12(D:+IN) IC2.3(A:+IN) IC2.5(B:+IN) IC2.10(C:+IN) IC2.11(P:V-) IC2.12(D:+IN) IC3.3(A:+IN) IC3.5(B:+IN) IC3.10(C:+IN) IC3.11(P:V-) IC3.12(D:+IN) IC4.3(A:+IN) IC4.5(B:+IN) IC4.10(C:+IN) IC4.11(P:V-) IC4.12(D:+IN) IC5.3(A:+IN) IC5.5(B:+IN) IC5.10(C:+IN) IC5.11(P:V-) IC5.12(D:+IN) IC6.3(A:+IN) IC6.5(B:+IN) IC6.10(C:+IN) IC6.11(P:V-) IC6.12(D:+IN) IC7.3(A:+IN) IC7.5(B:+IN) IC7.10(C:+IN) IC7.11(P:V-) IC7.12(D:+IN) IC8.3(A:+IN) IC8.5(B:+IN) IC8.10(C:+IN) IC8.11(P:V-) IC8.12(D:+IN) IC9.3(A:+IN) IC9.5(B:+IN) IC9.10(C:+IN) IC9.11(P:V-) IC9.12(D:+IN) IC10.3(A:+IN) IC10.5(B:+IN) IC10.10(C:+IN) IC10.11(P:V-) IC10.12(D:+IN) IC11.3(A:+IN) IC11.5(B:+IN) IC11.10(C:+IN) IC11.11(P:V-) IC11.12(D:+IN) IC12.3(A:+IN) IC12.5(B:+IN) IC12.10(C:+IN) IC12.11(P:V-) IC12.12(D:+IN) IC13.3(A:+IN) IC13.5(B:+IN) IC13.10(C:+IN) IC13.11(P:V-) IC13.12(D:+IN) IC14.3(A:+IN) IC14.5(B:+IN) IC14.10(C:+IN) IC14.11(P:V-) IC14.12(D:+IN) IC15.3(A:+IN) IC15.5(B:+IN) IC15.10(C:+IN) IC15.11(P:V-) IC15.12(D:+IN) IC16.3(A:+IN) IC16.5(B:+IN) IC16.10(C:+IN) IC16.11(P:V-) IC16.12(D:+IN) IC17.3(A:+IN) IC17.5(B:+IN) IC17.10(C:+IN) IC17.11(P:V-) IC17.12(D:+IN) IC18.3(A:+IN) IC18.5(B:+IN) IC18.10(C:+IN) IC18.11(P:V-) IC18.12(D:+IN) IC19.3(A:+IN) IC19.5(B:+IN) IC19.10(C:+IN) IC19.11(P:V-) IC19.12(D:+IN) IC20.3(A:+IN) IC20.5(B:+IN) IC20.10(C:+IN) IC20.11(P:V-) IC20.12(D:+IN) IC21.3(A:+IN) IC21.5(B:+IN) IC21.10(C:+IN) IC21.11(P:V-) IC21.12(D:+IN) IC22.3(A:+IN) IC22.5(B:+IN) IC22.10(C:+IN) IC22.11(P:V-) IC22.12(D:+IN) IC23.3(A:+IN) IC23.5(B:+IN) IC23.10(C:+IN) IC23.11(P:V-) IC23.12(D:+IN) IC24.3(A:+IN) IC24.5(B:+IN) IC24.10(C:+IN) IC24.11(P:V-) IC24.12(D:+IN) J2.6 PHD1.1 PHD1.2 PHD2.1 PHD2.2 PHD3.1 PHD3.2 PHD4.1 PHD4.2 PHD5.1 PHD5.2 PHD6.1 PHD6.2 PHD7.1 PHD7.2 PHD8.1 PHD8.2 PHD9.1 PHD9.2 PHD10.1 PHD10.2 PHD11.1 PHD11.2 PHD12.1 PHD12.2 PHD13.1 PHD13.2 PHD14.1 PHD14.2 PHD15.1 PHD15.2 PHD16.1 PHD16.2 PHD17.1 PHD17.2 PHD18.1 PHD18.2 PHD19.1 PHD19.2 PHD20.1 PHD20.2 PHD21.1 PHD21.2 PHD22.1 PHD22.2 PHD23.1 PHD23.2 PHD24.1 PHD24.2 PHD25.1 PHD25.2 PHD26.1 PHD26.2 PHD27.1 PHD27.2 PHD28.1 PHD28.2 PHD29.1 PHD29.2 PHD30.1 PHD30.2 PHD31.1 PHD31.2 PHD32.1 PHD32.2 PHD33.1 PHD33.2 PHD34.1 PHD34.2 PHD35.1 PHD35.2 PHD36.1 PHD36.2 PHD37.1 PHD37.2 PHD38.1 PHD38.2 PHD39.1 PHD39.2 PHD40.1 PHD40.2 PHD41.1 PHD41.2 PHD42.1 PHD42.2 PHD43.1 PHD43.2 PHD44.1 PHD44.2 PHD45.1 PHD45.2 PHD46.1 PHD46.2 PHD47.1 PHD47.2 PHD48.1 PHD48.2 PHD49.1 PHD49.2 PHD50.1 PHD50.2 PHD51.1 PHD51.2 PHD52.1 PHD52.2 PHD53.1 PHD53.2 PHD54.1 PHD54.2 PHD55.1 PHD55.2 PHD56.1 PHD56.2 PHD57.1 PHD57.2 PHD58.1 PHD58.2 PHD59.1 PHD59.2 PHD60.1 PHD60.2 PHD61.1 PHD61.2 PHD62.1 PHD62.2 PHD63.1 PHD63.2 PHD64.1 PHD64.2 PHD65.1 PHD65.2 PHD66.1 PHD66.2 PHD67.1 PHD67.2 PHD68.1 PHD68.2 PHD69.1 PHD69.2 PHD70.1 PHD70.2 PHD71.1 PHD71.2 PHD72.1 PHD72.2 PHD73.1 PHD73.2 PHD74.1 PHD74.2 PHD75.1 PHD75.2 PHD76.1 PHD76.2 PHD77.1 PHD77.2 PHD78.1 PHD78.2 PHD79.1 PHD79.2 PHD80.1 PHD80.2 PHD81.1 PHD81.2 PHD82.1 PHD82.2 PHD83.1 PHD83.2 PHD84.1 PHD84.2 PHD85.1 PHD85.2 PHD86.1 PHD86.2 PHD87.1 PHD87.2 PHD88.1 PHD88.2 PHD89.1 PHD89.2 PHD90.1 PHD90.2 PHD91.1 PHD91.2 PHD92.1 PHD92.2 PHD93.1 PHD93.2 PHD94.1 PHD94.2 PHD95.1 PHD95.2 PHD96.1 PHD96.2 U1.12(GND) U1.15(EN) U2.12(GND) U2.15(EN) U3.12(GND) U3.15(EN) U4.12(GND) U4.15(EN) U5.12(GND) U5.15(EN) U6.12(GND) U6.15(EN)
PD1: IC10.2(A:-IN) PHD1.3 PHD1.4 R11.1
PD2: IC10.6(B:-IN) PHD2.3 PHD2.4 R22.1
PD3: IC11.2(A:-IN) PHD3.3 PHD3.4 R12.1
PD4: IC11.6(B:-IN) PHD4.3 PHD4.4 R23.1
PD5: IC8.2(A:-IN) PHD5.3 PHD5.4 R9.1
PD6: IC8.6(B:-IN) PHD6.3 PHD6.4 R20.1
PD7: IC7.2(A:-IN) PHD7.3 PHD7.4 R8.1
PD8: IC7.6(B:-IN) PHD8.3 PHD8.4 R19.1
PD9: IC10.13(D:-IN) PHD9.3 PHD9.4 R38.1
PD10: IC10.9(C:-IN) PHD10.3 PHD10.4 R30.1
PD11: IC11.13(D:-IN) PHD11.3 PHD11.4 R39.1
PD12: IC11.9(C:-IN) PHD12.3 PHD12.4 R31.1
PD13: IC8.13(D:-IN) PHD13.3 PHD13.4 R36.1
PD14: IC8.9(C:-IN) PHD14.3 PHD14.4 R27.1
PD15: IC7.13(D:-IN) PHD15.3 PHD15.4 R35.1
PD16: IC7.9(C:-IN) PHD16.3 PHD16.4 R26.1
PD17: IC17.2(A:-IN) PHD17.3 PHD17.4 R66.1
PD18: IC17.6(B:-IN) PHD18.3 PHD18.4 R77.1
PD19: IC20.2(A:-IN) PHD19.3 PHD19.4 R70.1
PD20: IC20.6(B:-IN) PHD20.3 PHD20.4 R80.1
PD21: IC2.2(A:-IN) PHD21.3 PHD21.4 R5.1
PD22: IC2.6(B:-IN) PHD22.3 PHD22.4 R18.1
PD23: IC1.2(A:-IN) PHD23.3 PHD23.4 R4.1
PD24: IC1.6(B:-IN) PHD24.3 PHD24.4 R15.1
PD25: IC17.13(D:-IN) PHD25.3 PHD25.4 R90.1
PD26: IC17.9(C:-IN) PHD26.3 PHD26.4 R83.1
PD27: IC20.13(D:-IN) PHD27.3 PHD27.4 R96.1
PD28: IC20.9(C:-IN) PHD28.3 PHD28.4 R87.1
PD29: IC2.13(D:-IN) PHD29.3 PHD29.4 R41.1
PD30: IC2.9(C:-IN) PHD30.3 PHD30.4 R24.1
PD31: IC1.13(D:-IN) PHD31.3 PHD31.4 R44.1
PD32: IC1.9(C:-IN) PHD32.3 PHD32.4 R25.1
PD33: IC13.2(A:-IN) PHD33.3 PHD33.4 R49.1
PD34: IC13.6(B:-IN) PHD34.3 PHD34.4 R55.1
PD35: IC12.2(A:-IN) PHD35.3 PHD35.4 R48.1
PD36: IC12.6(B:-IN) PHD36.3 PHD36.4 R54.1
PD37: IC23.2(A:-IN) PHD37.3 PHD37.4 R72.1
PD38: IC23.6(B:-IN) PHD38.3 PHD38.4 R76.1
PD39: IC19.2(A:-IN) PHD39.3 PHD39.4 R71.1
PD40: IC19.6(B:-IN) PHD40.3 PHD40.4 R75.1
PD41: IC13.13(D:-IN) PHD41.3 PHD41.4 R65.1
PD42: IC13.9(C:-IN) PHD42.3 PHD42.4 R60.1
PD43: IC12.13(D:-IN) PHD43.3 PHD43.4 R64.1
PD44: IC12.9(C:-IN) PHD44.3 PHD44.4 R59.1
PD45: IC23.13(D:-IN) PHD45.3 PHD45.4 R94.1
PD46: IC23.9(C:-IN) PHD46.3 PHD46.4 R82.1
PD47: IC19.13(D:-IN) PHD47.3 PHD47.4 R92.1
PD48: IC19.9(C:-IN) PHD48.3 PHD48.4 R86.1
PD49: IC6.2(A:-IN) PHD49.3 PHD49.4 R1.1
PD50: IC6.6(B:-IN) PHD50.3 PHD50.4 R14.1
PD51: IC16.2(A:-IN) PHD51.3 PHD51.4 R47.1
PD52: IC16.6(B:-IN) PHD52.3 PHD52.4 R51.1
PD53: IC18.2(A:-IN) PHD53.3 PHD53.4 R69.1
PD54: IC18.6(B:-IN) PHD54.3 PHD54.4 R74.1
PD55: IC4.2(A:-IN) PHD55.3 PHD55.4 R3.1
PD56: IC4.6(B:-IN) PHD56.3 PHD56.4 R16.1
PD57: IC6.13(D:-IN) PHD57.3 PHD57.4 R42.1
PD58: IC6.9(C:-IN) PHD58.3 PHD58.4 R29.1
PD59: IC16.13(D:-IN) PHD59.3 PHD59.4 R61.1
PD60: IC16.9(C:-IN) PHD60.3 PHD60.4 R57.1
PD61: IC18.13(D:-IN) PHD61.3 PHD61.4 R91.1
PD62: IC18.9(C:-IN) PHD62.3 PHD62.4 R85.1
PD63: IC4.13(D:-IN) PHD63.3 PHD63.4 R40.1
PD64: IC4.9(C:-IN) PHD64.3 PHD64.4 R32.1
PD65: IC14.2(A:-IN) PHD65.3 PHD65.4 R46.1
PD66: IC14.6(B:-IN) PHD66.3 PHD66.4 R52.1
PD67: IC24.2(A:-IN) PHD67.3 PHD67.4 R67.1
PD68: IC24.6(B:-IN) PHD68.3 PHD68.4 R78.1
PD69: IC5.2(A:-IN) PHD69.3 PHD69.4 R7.1
PD70: IC5.6(B:-IN) PHD70.3 PHD70.4 R13.1
PD71: IC15.2(A:-IN) PHD71.3 PHD71.4 R50.1
PD72: IC15.6(B:-IN) PHD72.3 PHD72.4 R53.1
PD73: IC14.13(D:-IN) PHD73.3 PHD73.4 R62.1
PD74: IC14.9(C:-IN) PHD74.3 PHD74.4 R58.1
PD75: IC24.13(D:-IN) PHD75.3 PHD75.4 R95.1
PD76: IC24.9(C:-IN) PHD76.3 PHD76.4 R84.1
PD77: IC5.13(D:-IN) PHD77.3 PHD77.4 R43.1
PD78: IC5.9(C:-IN) PHD78.3 PHD78.4 R33.1
PD79: IC15.13(D:-IN) PHD79.3 PHD79.4 R63.1
PD80: IC15.9(C:-IN) PHD80.3 PHD80.4 R56.1
PD81: IC22.2(A:-IN) PHD81.3 PHD81.4 R68.1
PD82: IC22.6(B:-IN) PHD82.3 PHD82.4 R79.1
PD83: IC3.2(A:-IN) PHD83.3 PHD83.4 R2.1
PD84: IC3.6(B:-IN) PHD84.3 PHD84.4 R17.1
PD85: IC9.2(A:-IN) PHD85.3 PHD85.4 R10.1
PD86: IC9.6(B:-IN) PHD86.3 PHD86.4 R21.1
PD87: IC21.2(A:-IN) PHD87.3 PHD87.4 R73.1
PD88: IC21.6(B:-IN) PHD88.3 PHD88.4 R81.1
PD89: IC22.13(D:-IN) PHD89.3 PHD89.4 R93.1
PD90: IC22.9(C:-IN) PHD90.3 PHD90.4 R88.1
PD91: IC3.13(D:-IN) PHD91.3 PHD91.4 R45.1
PD92: IC3.9(C:-IN) PHD92.3 PHD92.4 R34.1
PD93: IC9.13(D:-IN) PHD93.3 PHD93.4 R37.1
PD94: IC9.9(C:-IN) PHD94.3 PHD94.4 R28.1
PD95: IC21.13(D:-IN) PHD95.3 PHD95.4 R97.1
PD96: IC21.9(C:-IN) PHD96.3 PHD96.4 R89.1
S0: J2.1 U1.10(SEL0) U2.10(SEL0) U3.10(SEL0) U4.10(SEL0) U5.10(SEL0) U6.10(SEL0)
S1: J2.2 U1.11(SEL1) U2.11(SEL1) U3.11(SEL1) U4.11(SEL1) U5.11(SEL1) U6.11(SEL1)
S2: J2.3 U1.14(SEL2) U2.14(SEL2) U3.14(SEL2) U4.14(SEL2) U5.14(SEL2) U6.14(SEL2)
S3: J2.4 U1.13(SEL3) U2.13(SEL3) U3.13(SEL3) U4.13(SEL3) U5.13(SEL3) U6.13(SEL3)

## Notes on the sheet
- POWER
- Copyright Miroculus 2016.
  This documentation describes Open Hardware and is licensed under the
  CERN OHL v. 1.2.
  You may redistribute and modify this documentation under the terms of the
  CERN OHL v.1.2. (http://ohwr.org/cernohl). This documentation is distributed
  WITHOUT ANY EXPRESS OR IMPLIED WARRANTY, INCLUDING OF
  MERCHANTABILITY, SATISFACTORY QUALITY AND FITNESS FOR A
  PARTICULAR PURPOSE. Please see the CERN OHL v.1.2 for applicable
  conditions
- Copyright Miroculus 2016.
  This documentation describes Open Hardware and is licensed under the
  CERN OHL v. 1.2.
  You may redistribute and modify this documentation under the terms of the
  CERN OHL v.1.2. (http://ohwr.org/cernohl). This documentation is distributed
  WITHOUT ANY EXPRESS OR IMPLIED WARRANTY, INCLUDING OF
  MERCHANTABILITY, SATISFACTORY QUALITY AND FITNESS FOR A
  PARTICULAR PURPOSE. Please see the CERN OHL v.1.2 for applicable
  conditions
- SENSOR BOARD V2
  JUHO TERRIJARVI
  BASED ON WORK BY
  ALEJANDRO V. BOFILL
  ARDUINO
- SENSOR BOARD V2
  JUHO TERRIJARVI
  BASED ON WORK BY
  ALEJANDRO V. BOFILL
  ARDUINO
- SENSOR BOARD V2
  JUHO TERRIJARVI
  BASED ON WORK BY
  ALEJANDRO V. BOFILL
  ARDUINO
- POWER/PORTS | PHOTODIODES | MULTILPLEXORS
- Copyright Miroculus 2016.
  This documentation describes Open Hardware and is licensed under the
  CERN OHL v. 1.2.
  You may redistribute and modify this documentation under the terms of the
  CERN OHL v.1.2. (http://ohwr.org/cernohl). This documentation is distributed
  WITHOUT ANY EXPRESS OR IMPLIED WARRANTY, INCLUDING OF
  MERCHANTABILITY, SATISFACTORY QUALITY AND FITNESS FOR A
  PARTICULAR PURPOSE. Please see the CERN OHL v.1.2 for applicable
  conditions
- Copyright Miroculus 2016.
  This documentation describes Open Hardware and is licensed under the
  CERN OHL v. 1.2.
  You may redistribute and modify this documentation under the terms of the
  CERN OHL v.1.2. (http://ohwr.org/cernohl). This documentation is distributed
  WITHOUT ANY EXPRESS OR IMPLIED WARRANTY, INCLUDING OF
  MERCHANTABILITY, SATISFACTORY QUALITY AND FITNESS FOR A
  PARTICULAR PURPOSE. Please see the CERN OHL v.1.2 for applicable
  conditions
- Copyright Miroculus 2016.
  This documentation describes Open Hardware and is licensed under the
  CERN OHL v. 1.2.
  You may redistribute and modify this documentation under the terms of the
  CERN OHL v.1.2. (http://ohwr.org/cernohl). This documentation is distributed
  WITHOUT ANY EXPRESS OR IMPLIED WARRANTY, INCLUDING OF
  MERCHANTABILITY, SATISFACTORY QUALITY AND FITNESS FOR A
  PARTICULAR PURPOSE. Please see the CERN OHL v.1.2 for applicable
  conditions
- Copyright Miroculus 2016.
  This documentation describes Open Hardware and is licensed under the
  CERN OHL v. 1.2.
  You may redistribute and modify this documentation under the terms of the
  CERN OHL v.1.2. (http://ohwr.org/cernohl). This documentation is distributed
  WITHOUT ANY EXPRESS OR IMPLIED WARRANTY, INCLUDING OF
  MERCHANTABILITY, SATISFACTORY QUALITY AND FITNESS FOR A
  PARTICULAR PURPOSE. Please see the CERN OHL v.1.2 for applicable
  conditions
- SENSOR BOARD V2
  JUHO TERRIJARVI
  BASED ON WORK BY
  ALEJANDRO V. BOFILL
  ARDUINO
- SENSOR BOARD V2
  JUHO TERRIJARVI
  BASED ON WORK BY
  ALEJANDRO V. BOFILL
  ARDUINO
- SENSOR BOARD V2
  JUHO TERRIJARVI
  BASED ON WORK BY
  ALEJANDRO V. BOFILL
  ARDUINO
- AMPLIFIERS 1 | AMPLIFIERS 2 | AMPLIFIERS 3
- Copyright Miroculus 2016.
  This documentation describes Open Hardware and is licensed under the
  CERN OHL v. 1.2.
  You may redistribute and modify this documentation under the terms of the
  CERN OHL v.1.2. (http://ohwr.org/cernohl). This documentation is distributed
  WITHOUT ANY EXPRESS OR IMPLIED WARRANTY, INCLUDING OF
  MERCHANTABILITY, SATISFACTORY QUALITY AND FITNESS FOR A
  PARTICULAR PURPOSE. Please see the CERN OHL v.1.2 for applicable
  conditions
- Copyright Miroculus 2016.
  This documentation describes Open Hardware and is licensed under the
  CERN OHL v. 1.2.
  You may redistribute and modify this documentation under the terms of the
  CERN OHL v.1.2. (http://ohwr.org/cernohl). This documentation is distributed
  WITHOUT ANY EXPRESS OR IMPLIED WARRANTY, INCLUDING OF
  MERCHANTABILITY, SATISFACTORY QUALITY AND FITNESS FOR A
  PARTICULAR PURPOSE. Please see the CERN OHL v.1.2 for applicable
  conditions
- Copyright Miroculus 2016.
  This documentation describes Open Hardware and is licensed under the
  CERN OHL v. 1.2.
  You may redistribute and modify this documentation under the terms of the
  CERN OHL v.1.2. (http://ohwr.org/cernohl). This documentation is distributed
  WITHOUT ANY EXPRESS OR IMPLIED WARRANTY, INCLUDING OF
  MERCHANTABILITY, SATISFACTORY QUALITY AND FITNESS FOR A
  PARTICULAR PURPOSE. Please see the CERN OHL v.1.2 for applicable
  conditions
- SENSOR BOARD V2
  JUHO TERRIJARVI
  BASED ON WORK BY
  ALEJANDRO V. BOFILL
  ARDUINO
- SENSOR BOARD V2
  JUHO TERRIJARVI
  BASED ON WORK BY
  ALEJANDRO V. BOFILL
  ARDUINO
- SENSOR BOARD V2
  JUHO TERRIJARVI
  BASED ON WORK BY
  ALEJANDRO V. BOFILL
  ARDUINO
- AMPLIFIERS 4 | AMPLIFIERS 5 | AMPLIFIERS 6

## Library data of the parts
C1-C23 C25 = rcl:C-EU: CAPACITOR, European symbol
FD1-FD6 = SmartPrj:FIDUCIALMOUNT
IC1-IC24 = linear:TL074: OP AMP
J1 J2 = Eagle_FPC_CONNECTOR_AND_FFC_CAB (rev18c):68710614522: WE-FPC 0.5mm SMT ZIF Horizontal Bottom Contact, 6 Pins=>Code : Con_FPC_ZIF_0.50_68710614522 <http://katalog.we-online.de/media/images/eican/Con_FPC_ZIF_0.50_6871xx14522_pf2.jpg> Details see: http://katalog.we-online.de/en/em/687_1xx_145_22 Created 2014-07-09, Karrer Zheng 2014 (C) Würth Elektronik
PHD1-PHD96 = Miroculus:PD_0.2
R1-R5 R7-R97 = rcl:R-EU_: RESISTOR, European symbol
U1-U6 = microbuilder:MUX-1X16: 1x16 Channel Analog Multiplexer/Demultiplexer [Part No.] Texas Instruments CD74HC4067 Digikey: 296-9226-6-ND

## Net classes
0 default: width 0.254 mm, drill 0.406 mm, clearance 0.127 mm
1 power: width 0.406 mm, drill 0.406 mm, clearance 0.305 mm
2 gnd: width 0.254 mm, drill 0.406 mm, clearance 0.254 mm
3 power usb: width 0.254 mm, drill 0.406 mm, clearance 0.254 mm
4 power12: width 1.778 mm, drill 0.889 mm, clearance 0.254 mm